# Altium project GSM.PrjPcb
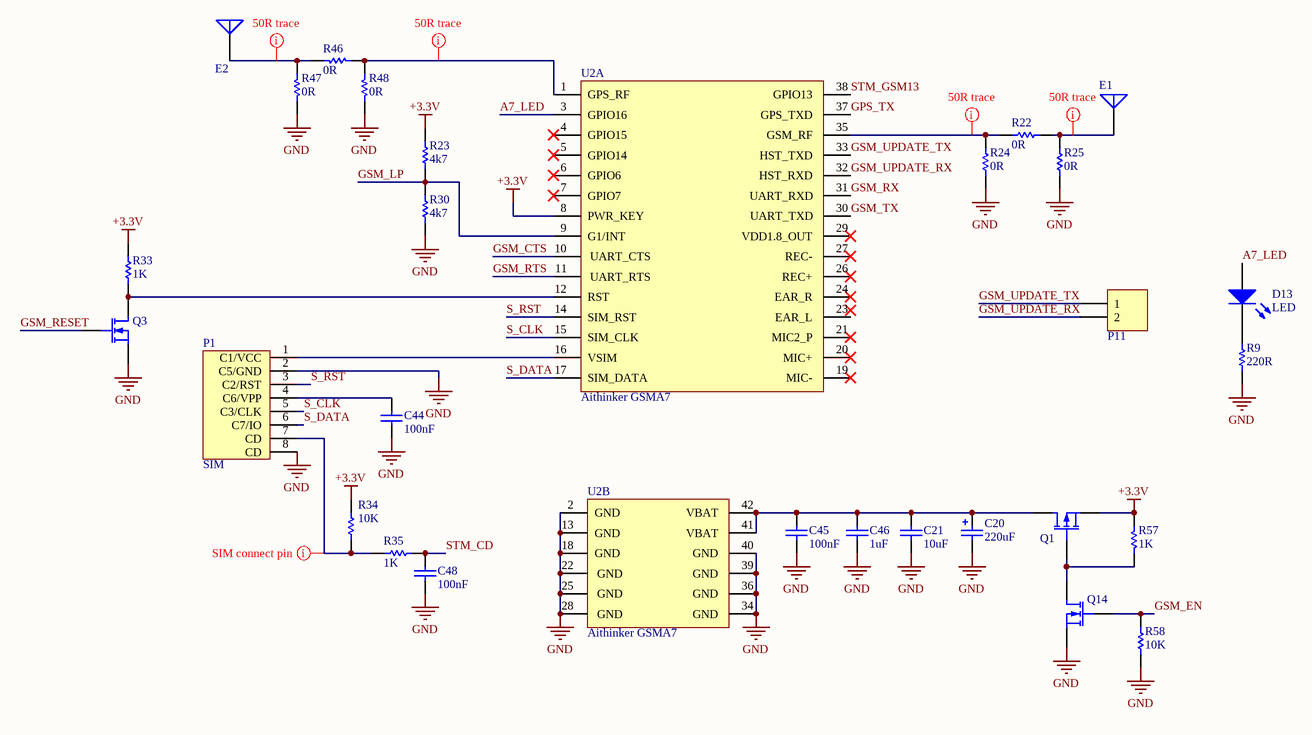
[diagram p0: GSM.SchDoc]
ProjectTitle: GSM
5 sheets, 227 parts. Net scope: global (net labels, ports and power ports of the same name join across sheets).
Board files: GSM.PcbDoc, GSM_v2.PcbDoc
Sheets:
  GSM.SchDoc
  power.SchDoc
  sensors.SchDoc
  mcu.SchDoc
  wifi.SchDoc

## Sheet GSM.SchDoc
size A3

### Parts
C20  value 220uF  [CAP-D]  (hidden comment: Tantalum 220uF)
C21  value 10uF  [C0603]  (hidden comment: Cap 10uF)
C44  value 100nF  [C0402]  (hidden comment: Cap 100nF)
C45  value 100nF  [C0402]  (hidden comment: Cap 100nF)
C46  value 1uF  [C0402]  (hidden comment: Cap 1uF)
C48  value 100nF  [C0402]  (hidden comment: Cap 100nF)
D13  LED  [0603LedRed]
E1  Antenna  [SMA connector]  (value not drawn)
E2  Antenna  [SMA connector]  (value not drawn)
P1  SIM  [SIM TRAY]
P11  Header 2  [HDR1X2]  (value not drawn)
Q1  AO3401A  [SOT23]  (value not drawn)
Q3  AO3400A  [SOT23]  (value not drawn)
Q14  AO3400A  [SOT23]  (value not drawn)
R9  value 220R  [R0402]  (hidden comment: Res_220R)
R22  value 0R  [R0402]  (hidden comment: Res_0R)
R23  value 4k7  [R0402]  (hidden comment: Res_4k7)
R24  value 0R  [R0402]  (hidden comment: Res_0R)
R25  value 0R  [R0402]  (hidden comment: Res_0R)
R30  value 4k7  [R0402]  (hidden comment: Res_4k7)
R33  value 1K  [R0402]  (hidden comment: Res_1K)
R34  value 10K  [R0402]  (hidden comment: Res_10K)
R35  value 1K  [R0402]  (hidden comment: Res_1K)
R46  value 0R  [R0402]  (hidden comment: Res_0R)
R47  value 0R  [R0402]  (hidden comment: Res_0R)
R48  value 0R  [R0402]  (hidden comment: Res_0R)
R57  value 1K  [R0402]  (hidden comment: Res_1K)
R58  value 10K  [R0402]  (hidden comment: Res_10K)
U2  Aithinker GSMA7  [A7]  (parts A,B of 2)

### Nets
+3.3V: Q1.2(S) R23.2 R33.2 R34.2 R57.2 U2.8(PWR_KEY)
GND: C20.1 C21.1 C44.1 C45.1 C46.1 C48.1 P1.2(C5/GND) P1.8(CD) Q3.2(S) Q14.2(S) R9.1 R24.1 R25.1 R30.1 R47.1 R48.1 R58.1 U2.2(GND) U2.13(GND) U2.18(GND) U2.22(GND) U2.25(GND) U2.28(GND) U2.34(GND) U2.36(GND) U2.39(GND) U2.40(GND)
A7_LED: D13.1(A) U2.3(GPIO16)
GPS_TX: U2.37(GPS_TXD)
GSM_CTS: U2.10(UART_CTS)
GSM_EN: Q14.1(G) R58.2
GSM_LP: R23.1 R30.2 U2.9(G1/INT)
GSM_RESET: Q3.1(G)
GSM_RTS: U2.11(UART_RTS)
GSM_RX: U2.31(UART_RXD)
GSM_TX: U2.30(UART_TXD)
GSM_UPDATE_RX: P11.2 U2.32(HST_RXD)
GSM_UPDATE_TX: P11.1 U2.33(HST_TXD)
S_CLK: P1.5(C3/CLK) U2.15(SIM_CLK)
S_DATA: P1.6(C7/IO) U2.17(SIM_DATA)
S_RST: P1.3(C2/RST) U2.14(SIM_RST)
STM_CD: C48.2 R35.2
STM_GSM13: U2.38(GPIO13)
NetC20_2: C20.2 C21.2 C45.2 C46.2 Q1.3(D) U2.41(VBAT) U2.42(VBAT)
NetC44_2: C44.2 P1.4(C6/VPP)
NetD13_2: D13.2(K) R9.2
NetE1_1: E1.1(A) R22.2 R25.2
NetE2_1: E2.1(A) R46.2 R47.2
NetP1_1: P1.1(C1/VCC) U2.16(VSIM)
NetP1_7: P1.7(CD) R34.1 R35.1
NetQ1_1: Q1.1(G) Q14.3(D) R57.1
NetQ3_3: Q3.3(D) R33.1 U2.12(RST)
NetR22_1: R22.1 R24.2 U2.35(GSM_RF)
NetR46_1: R46.1 R48.2 U2.1(GPS_RF)

Not connected (* = marked no-connect by the designer): U2 4(GPIO15)* 5(GPIO14)* 6(GPIO6)* 7(GPIO7)* 19(MIC-)* 20(MIC+)* 21(MIC2_P)* 23(EAR_L) 24(EAR_R)* 26(REC+)* 27(REC-)* 29(VDD1.8_OUT)*

### Layout directives
mark named 50R trace: NetE1_1, NetE2_1, NetR22_1, NetR46_1
mark named SIM connect pin: NetP1_7

### Library data of the parts
C20 = Tantalum 220uF: Polarized Tantalum Capacitor
C21 = Cap 10uF: Capacitor
C44 C45 C48 = Cap 100nF: Capacitor
C46 = Cap 1uF: Capacitor
D13 = LED: Typical RED GaAs LED; Published: 8-Jun-2000; LatestRevisionDate: 08-Jul-2005; LatestRevisionNote: Mech Layer 1 removed.; PackageReference: LED-1; Publisher: Altium Limited; PackageDescription: LED; 2 Leads
E1 E2 = Antenna: Generic Antenna; Published: 24-Mar-1999; LatestRevisionDate: 17-Jul-2002; LatestRevisionNote: Re-released for DXP Platform.; PackageReference: PIN1; Publisher: Altium Limited; ComponentLink1Description: tme; ComponentLink1URL: https://www.tme.eu/pl/details/rf2-19a-t-00-50-g/zlacza-sma-smb-smc/adam-tech/
P1 = SIM: SIM card connector; ComponentLink1Description: tme; ComponentLink1URL: https://www.tme.eu/pl/details/mx-47553-0001/zlacza-do-kart/molex/47553-0001/; ComponentLink2Description: molex; ComponentLink2URL: https://www.molex.com/molex/products/part-detail/memory_card_socket/0475530001
P11 = Header 2: Header, 2-Pin; LatestRevisionDate: 17-Jul-2002; LatestRevisionNote: Re-released for DXP Platform.; Publisher: Altium Limited
Q1 = MOSFET-P: P-Channel MOSFET AO3401A; Published: 8-Jun-2000; LatestRevisionDate: 17-Jul-2002; LatestRevisionNote: Re-released for DXP Platform.; PackageVersion: 1995/1996; PackageReference: E3; Publisher: Altium Limited; PackageDescription: TO, Flat Index; 3 In-Line, Axial Leads; Body Dia. 4.6mm; Lead Dia. 0.5 mm (max); ComponentLink1Description: datasheet; ComponentLink1URL: https://datasheet.lcsc.com/szlcsc/Alpha-Omega-Semicon-AOS-AO3401A_C15127.pdf
Q3 Q14 = MOSFET-N: N-MOSFET AO3400A; Published: 8-Jun-2000; LatestRevisionDate: 17-Jul-2002; LatestRevisionNote: Re-released for DXP Platform.; PackageVersion: 1995/1996; PackageReference: E3; Publisher: Altium Limited; PackageDescription: TO, Flat Index; 3 In-Line, Axial Leads; Body Dia. 4.6mm; Lead Dia. 0.5 mm (max); ComponentLink1Description: datasheet; ComponentLink1URL: https://datasheet.lcsc.com/szlcsc/1908271131_Youtai-Semiconductor-Co-Ltd-AO3400A_C347475.pdf
R9 = Res_220R: Resistor
R22 R24 R25 R46-R48 = Res_0R: Resistor
R23 R30 = Res_4k7: Resistor
R33 R35 R57 = Res_1K: Resistor
R34 R58 = Res_10K: Resistor
U2 = GSM_A7: Aitkinker GSM A7 module; Manufacturer: STMicroelectronics; PartNumber: STM32L152CCU6; Core: ARM Cortex-M3; D/A Converter: 2x12-bit (2 Channel); Data E2PROM nom (B): 8192; Display controller: LCD 4x18; FLASH Size (Prog) (kB): 256; I/Os (High Current): 37; Internal RAM Size (kB): 32; Packing: Tray; Supply Voltage(Vcc) min (V): 1.65; DatasheetVersion: Rev. 3; PackageVersion: Rev. 1, 04/2013; PackageReference: UFQFPN48; PackageDescription: 48-Pin Ultra Thin Fine Pitch Quad Flat No-Lead, 7 x 7 x 0.6 mm Body, 0.5 mm Pitch, Exposed Pad; Operating Frequency(F) (Processor speed) (MHz): 32; Mounting Technology: Surface Mount

## Sheet power.SchDoc
size A4
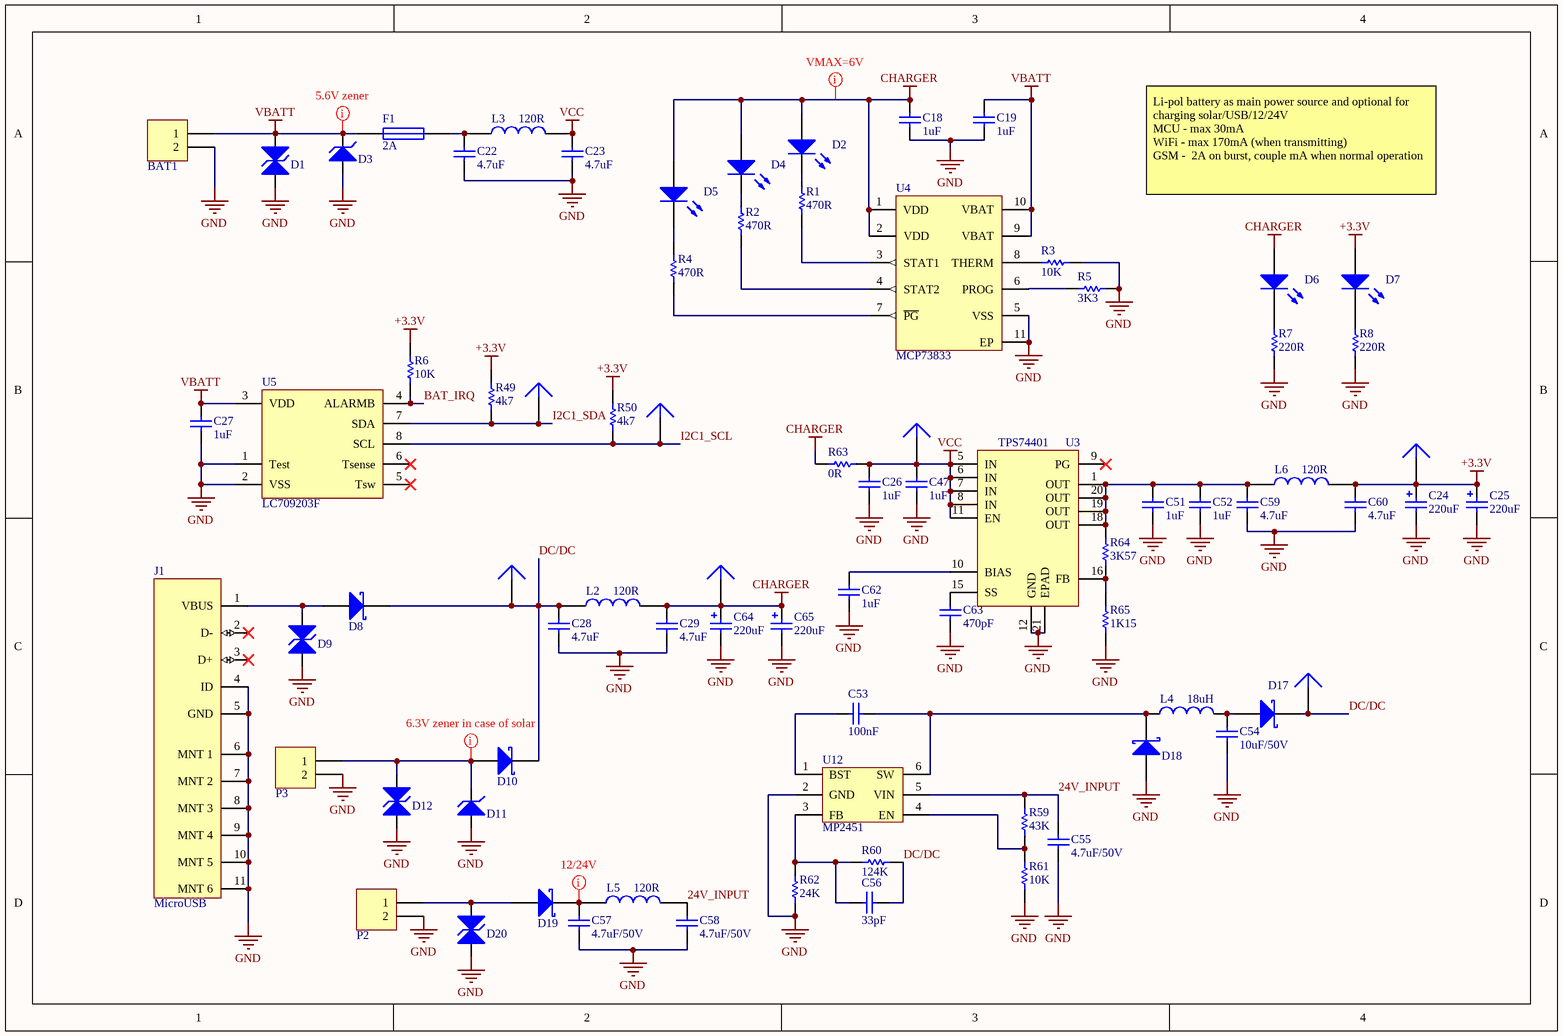
[diagram p1: power.SchDoc]

### Parts
BAT1  Header 2  [HDR1X2]  (value not drawn)
C18  value 1uF  [C0402]  (hidden comment: Cap 1uF)
C19  value 1uF  [C0402]  (hidden comment: Cap 1uF)
C22  value 4.7uF  [C0402]  (hidden comment: Cap 4.7uF)
C23  value 4.7uF  [C0402]  (hidden comment: Cap 4.7uF)
C24  value 220uF  [CAP-D]  (hidden comment: Tantalum 220uF)
C25  value 220uF  [CAP-D]  (hidden comment: Tantalum 220uF)
C26  value 1uF  [C0402]  (hidden comment: Cap 1uF)
C27  value 1uF  [C0402]  (hidden comment: Cap 1uF)
C28  value 4.7uF  [C0402]  (hidden comment: Cap 4.7uF)
C29  value 4.7uF  [C0402]  (hidden comment: Cap 4.7uF)
C47  value 1uF  [C0402]  (hidden comment: Cap 1uF)
C51  value 1uF  [C0402]  (hidden comment: Cap 1uF)
C52  value 1uF  [C0402]  (hidden comment: Cap 1uF)
C53  value 100nF  [C0402]  (hidden comment: Cap 100nF)
C54  value 10uF/50V  [C1206]  (hidden comment: Cap 10uF/50V)
C55  value 4.7uF/50V  [C1206]  (hidden comment: Cap 4.7uF/50V)
C56  value 33pF  [C0402]  (hidden comment: Cap 33pF)
C57  value 4.7uF/50V  [C1206]  (hidden comment: Cap 4.7uF/50V)
C58  value 4.7uF/50V  [C1206]  (hidden comment: Cap 4.7uF/50V)
C59  value 4.7uF  [C0402]  (hidden comment: Cap 4.7uF)
C60  value 4.7uF  [C0402]  (hidden comment: Cap 4.7uF)
C62  value 1uF  [C0402]  (hidden comment: Cap 1uF)
C63  value 470pF  [C0402]  (hidden comment: Cap 470pF)
C64  value 220uF  [CAP-D]  (hidden comment: Tantalum 220uF)
C65  value 220uF  [CAP-D]  (hidden comment: Tantalum 220uF)
D1  TVS Bidirectional  [SMA]  (value not drawn)
D2  LED  [0603LedRed]  (value not drawn)
D3  Zener Diode  [miniMELF]  (value not drawn)
D4  LED  [0603LedRed]  (value not drawn)
D5  LED  [0603LedRed]  (value not drawn)
D6  LED  [0603LedRed]  (value not drawn)
D7  LED  [0603LedRed]  (value not drawn)
D8  STPS1L30U  [SOD-123A]  (value not drawn)
D9  TVS Bidirectional  [SMA]  (value not drawn)
D10  STPS1L30U  [SOD-123A]  (value not drawn)
D11  Zener Diode  [miniMELF]  (value not drawn)
D12  TVS Bidirectional  [SMA]  (value not drawn)
D17  D Schottky  [SOD-123A]  (value not drawn)
D18  STPS1L30U  [SOD-123A]  (value not drawn)
D19  STPS1L30U  [SOD-123A]  (value not drawn)
D20  TVS Bidirectional  [SMA]  (value not drawn)
F1  2A  [R1206]
J1  MicroUSB  [MicroUSB]
L2  120R  [0805FerriteBead]
L3  120R  [0805FerriteBead]
L4  value 18uH  [WE-TPC_4828]  (hidden comment: Inductor 18uH)
L5  120R  [0805FerriteBead]
L6  120R  [0805FerriteBead]
P2  Header 2  [HDR1x2_screw]  (value not drawn)
P3  Header 2  [HDR1x2_screw]  (value not drawn)
P12  Plug  [pin smd]  (value not drawn)  (no BOM)
P13  Plug  [pin smd]  (value not drawn)  (no BOM)
P15  Plug  [pin smd]  (value not drawn)  (no BOM)
P16  Plug  [pin smd]  (value not drawn)  (no BOM)
P17  Plug  [pin smd]  (value not drawn)  (no BOM)
P18  Plug  [pin smd]  (value not drawn)  (no BOM)
P19  Plug  [pin smd]  (value not drawn)  (no BOM)
R1  value 470R  [R0402]  (hidden comment: Res_470R)
R2  value 470R  [R0402]  (hidden comment: Res_470R)
R3  value 10K  [R0402]  (hidden comment: Res_10K)
R4  value 470R  [R0402]  (hidden comment: Res_470R)
R5  value 3K3  [R0402]  (hidden comment: Res_3K3)
R6  value 10K  [R0402]  (hidden comment: Res_10K)
R7  value 220R  [R0402]  (hidden comment: Res_220R)
R8  value 220R  [R0402]  (hidden comment: Res_220R)
R49  value 4k7  [R0402]  (hidden comment: Res_4k7)
R50  value 4k7  [R0402]  (hidden comment: Res_4k7)
R59  value 43K  [R0402]  (hidden comment: Res_43K)
R60  value 124K  [R0402]  (hidden comment: Res_124K)
R61  value 10K  [R0402]  (hidden comment: Res_10K)
R62  value 24K  [R0402]  (hidden comment: Res_24K)
R63  value 0R  [R0402]  (hidden comment: Res_0R)
R64  value 3K57  [R0402]  (hidden comment: Res_3K57)
R65  value 1K15  [R0402]  (hidden comment: Res_1K15)
U3  TPS74401  [PVQFN20]
U4  MCP73833  [DFN 3x3]
U5  LC709203F  [WDFN8]
U12  MP2451  [SOT23-6]

### Nets
+3.3V: C24.2 C25.2 C60.2 D7.1(A) L6.2 P16.1 R6.2 R49.2 R50.2
CHARGER: C18.2 C29.2 C64.2 C65.2 D2.1(A) D4.1(A) D5.1(A) D6.1(A) L2.2 P18.1 R63.1 U4.1(VDD) U4.2(VDD)
GND: BAT1.2 C18.1 C19.1 C22.1 C23.1 C24.1 C25.1 C26.1 C27.1 C28.1 C29.1 C47.1 C51.1 C52.1 C54.1 C55.1 C57.1 C58.1 C59.1 C60.1 C62.1 C63.1 C64.1 C65.1 D1.1 D3.1(A) D9.1 D11.1(A) D12.1 D18.1(A) D20.1 J1.4(ID) J1.5(GND) J1.6(MNT_1) J1.7(MNT_2) J1.8(MNT_3) J1.9(MNT_4) J1.10(MNT_5) J1.11(MNT_6) P2.2 P3.2 R3.2 R5.2 R7.1 R8.1 R61.1 R62.1 R65.1 U3.12(GND) U3.21(EPAD) U4.5(VSS) U4.11(EP) U5.1(Test) U5.2(VSS) U12.2(GND)
VBATT: BAT1.1 C19.2 C27.2 D1.2 D3.2(K) F1.1 U4.9(VBAT) U4.10(VBAT) U5.3(VDD)
VCC: C23.2 C26.2 C47.2 L3.2 P15.1 R63.2 U3.5(IN) U3.6(IN) U3.7(IN) U3.8(IN) U3.11(EN)
24V_INPUT: C55.2 C58.2 L5.2 R59.2 U12.5(VIN)
BAT_IRQ: R6.1 U5.4(ALARMB)
DC/DC: C28.2 C56.2 D8.2(K) D10.2(K) D17.2(K) L2.1 P17.1 P19.1 R60.2
I2C1_SCL: P13.1 R50.1 U5.8(SCL)
I2C1_SDA: P12.1 R49.1 U5.7(SDA)
NetC22_2: C22.2 F1.2 L3.1
NetC51_2: C51.2 C52.2 C59.2 L6.1 R64.2 U3.1(OUT) U3.18(OUT) U3.19(OUT) U3.20(OUT)
NetC53_1: C53.1 U12.1(BST)
NetC53_2: C53.2 D18.2(K) L4.1 U12.6(SW)
NetC54_2: C54.2 D17.1(A) L4.2
NetC56_1: C56.1 R60.1 R62.2 U12.3(FB)
NetC57_2: C57.2 D19.2(K) L5.1
NetC62_2: C62.2 U3.10(BIAS)
NetC63_2: C63.2 U3.15(SS)
NetD2_2: D2.2(K) R1.2
NetD4_2: D4.2(K) R2.2
NetD5_2: D5.2(K) R4.2
NetD6_2: D6.2(K) R7.2
NetD7_2: D7.2(K) R8.2
NetD8_1: D8.1(A) D9.2 J1.1(VBUS)
NetD10_1: D10.1(A) D11.2(K) D12.2 P3.1
NetD19_1: D19.1(A) D20.2 P2.1
NetR1_1: R1.1 U4.3(STAT1)
NetR2_1: R2.1 U4.4(STAT2)
NetR3_1: R3.1 U4.8(THERM)
NetR4_1: R4.1 U4.7(~{PG})
NetR5_1: R5.1 U4.6(PROG)
NetR59_1: R59.1 R61.2 U12.4(EN)
NetR64_1: R64.1 R65.2 U3.16(FB)

Not connected (* = marked no-connect by the designer): J1 2(D-)* 3(D+)*; U3 9(PG)*; U5 5(Tsw)* 6(Tsense)*

### Layout directives
mark named 6.3V zener in case of solar: NetD10_1
mark named 5.6V zener: VBATT
mark named VMAX=6V: CHARGER
mark named 12/24V: NetC57_2

### Notes on the sheet
- Li-pol battery as main power source and optional for charging solar/USB/12/24V
  MCU - max 30mA
  WiFi - max 170mA (when transmitting)
  GSM -  2A on burst, couple mA when normal operation

### Library data of the parts
BAT1 P2 P3 = Header 2: Header, 2-Pin; LatestRevisionDate: 17-Jul-2002; LatestRevisionNote: Re-released for DXP Platform.; Publisher: Altium Limited
C18 C19 C26 C27 C47 C51 C52 C62 = Cap 1uF: Capacitor
C22 C23 C28 C29 C59 C60 = Cap 4.7uF: Capacitor
C24 C25 C64 C65 = Tantalum 220uF: Polarized Tantalum Capacitor
C53 = Cap 100nF: Capacitor
C54 = Cap 10uF/50V: Capacitor
C55 C57 C58 = Cap 4.7uF/50V: Capacitor
C56 = Cap 33pF: Capacitor
C63 = Cap 470pF: Capacitor
D1 D9 D12 D20 = TVS_bidirectional: SMAJ40CA; Published: 8-Jun-2000; LatestRevisionDate: 17-Jul-2002; LatestRevisionNote: Re-released for DXP Platform.; PackageReference: DIODE-0.7; Publisher: Altium Limited; PackageDescription: Diode, Thru-Hole; 2 Leads; 0.7 in Pin Spacing; ComponentLink1Description: datasheet; ComponentLink1URL: https://datasheet.lcsc.com/szlcsc/1912111437_Jiangsu-JieJie-Microelectronics-SMAJ40CA_C364660.pdf
D2 D4-D7 = LED: Typical RED GaAs LED; Published: 8-Jun-2000; LatestRevisionDate: 08-Jul-2005; LatestRevisionNote: Mech Layer 1 removed.; PackageReference: LED-1; Publisher: Altium Limited; PackageDescription: LED; 2 Leads
D3 D11 = Diode Zener: Published: 8-Jun-2000; LatestRevisionDate: 17-Jul-2002; LatestRevisionNote: Re-released for DXP Platform.; PackageReference: DIODE-0.7; Publisher: Altium Limited; PackageDescription: Diode, Thru-Hole; 2 Leads; 0.7 in Pin Spacing; ComponentLink1Description: farnell; ComponentLink1URL: https://pl.farnell.com/on-semiconductor/mm3z5v6st1g/zener-diode-5-6v-sod-323/dp/2463484
D8 D10 D18 D19 = Diode Schottky: Schottky Rectifier; Note: Terminal 2 is the TAB and is electrically connected to the cathode; Published: 8-Jun-2000; LatestRevisionDate: 17-Jul-2002; LatestRevisionNote: Re-released for DXP Platform.; DatasheetVersion: Dec-1997; PackageVersion: Feb-1998; PackageReference: TO-220AC; Publisher: Altium Limited; PackageDescription: TO, Thru-Hole, Vertical, Heatsink Mounted; 3 In-Line Leads (1 Absent); Pitch 2.54 mm; ComponentLink1Description: octopart; ComponentLink1URL: https://octopart.com/rb161mm-20tr-rohm-50255147?r=sp&s=49MKJYpmTviEGZkvRDL2JQ
D17 = D Schottky: Schottky Diode; Published: 8-Jun-2000; LatestRevisionDate: 17-Jul-2002; LatestRevisionNote: Re-released for DXP Platform.; PackageReference: SMB; Publisher: Altium Limited; PackageDescription: DO-214-AA/SMB; 2 C-Bend Leads; Body 5.3 x 3.6 mm, inc. leads (LxW); Code_JEDEC: DO-214-AA
F1 = Fuse_2A: Fuse / 2850030; Published: 8-Jun-2000; LatestRevisionDate: 17-Jul-2002; LatestRevisionNote: Re-released for DXP Platform.; PackageReference: PIN-W2/E2.8; Publisher: Altium Limited; PackageDescription: Thru-Hole; 2 Leads; ComponentLink1Description: farnell; ComponentLink1URL: https://pl.farnell.com/multicomp/mccfb1206ttt-2/fuse-smd-2a-slow-blow-1206/dp/2850030
L2 L3 L5 L6 = Ferrite bead 120R: Ferrite bead; Value: 10mH; Published: 24-Mar-1999; LatestRevisionDate: 17-Jul-2002; LatestRevisionNote: Re-released for DXP Platform.; PackageReference: AXIAL-0.9; Publisher: Altium Limited; PackageDescription: Axial Device, Thru-Hole; 2 Leads; 0.9 in Pin Spacing; ComponentLink1Description: Ferrite bead TDK MMZ2012Y300B; ComponentLink1URL: https://www.tme.eu/pl/details/mmz2012y300b/ferryty-koraliki/tdk/
L4 = Inductor 18uH: WE 744 043 180; Code_IEC: 1005; Published: 8-Jun-2000; LatestRevisionDate: 29-May-2009; LatestRevisionNote: IPC-7351 Footprint Added.; PackageReference: 0402-A; Publisher: Altium Limited; PackageDescription: Chip Inductor; Code_JEITA: 0402
R1 R2 R4 = Res_470R: Resistor
R3 R6 R61 = Res_10K: Resistor
R5 = Res_3K3: Resistor
R7 R8 = Res_220R: Resistor
R49 R50 = Res_4k7: Resistor
R59 = Res_43K: Resistor
R60 = Res_124K: Resistor
R62 = Res_24K: Resistor
R63 = Res_0R: Resistor
R64 = Res_3K57: Resistor
R65 = Res_1K15: Resistor
U3 = TPS74401: Very Low Dropout Regulator; ComponentLink1Description: datasheet; ComponentLink1URL: https://datasheet.lcsc.com/szlcsc/Texas-Instruments-TI-TPS74401RGWR_C138728.pdf
U4 = MCP73833: Li-Ion, Li-Polymer Charge Management Controller; PartNumber: MCP73831T-2ATI/OT; PackageDescription: 5-Lead Plastic Small Outline Transistor (OT) [SOT-23]; PackageVersion: revBB, Aug-2009; DatasheetVersion: revE, Sep-2008; Code_IPC: SOT23-5; PackageReference: SOT-23-OT5; ComponentLink1Description: octopart; ComponentLink1URL: https://octopart.com/mcp73833-fci%2Fmf-microchip-664198?r=sp&s=e45vLxEIQu2vH537JitsJQ
U5 = LC709203F: Smart LiB GaugeBattery Fuel Gauge LSI For 1‐Cell Lithium‐ion/Polymer (Li+); ComponentLink1Description: Datasheet; ComponentLink1URL: https://www.onsemi.com/pub/Collateral/LC709203F-D.PDF
U12 = MP2451: step down coverter; ComponentLink1Description: datasheet; ComponentLink1URL: https://www.monolithicpower.com/en/documentview/productdocument/index/version/2/document_type/Datasheet/lang/en/sku/MP2451/document_id/253/
J1 = MicroUSB: ComponentLink1Description: octopart; ComponentLink1URL: https://octopart.com/1050170001-molex-11866487?r=sp&s=Rj0fqO-uQZ6OfaPf4COaug
P12 P13 P15-P19 = Plug: LatestRevisionDate: 17-Jul-2002; LatestRevisionNote: Re-released for DXP Platform.; Publisher: Altium Limited

## Sheet sensors.SchDoc
size A4
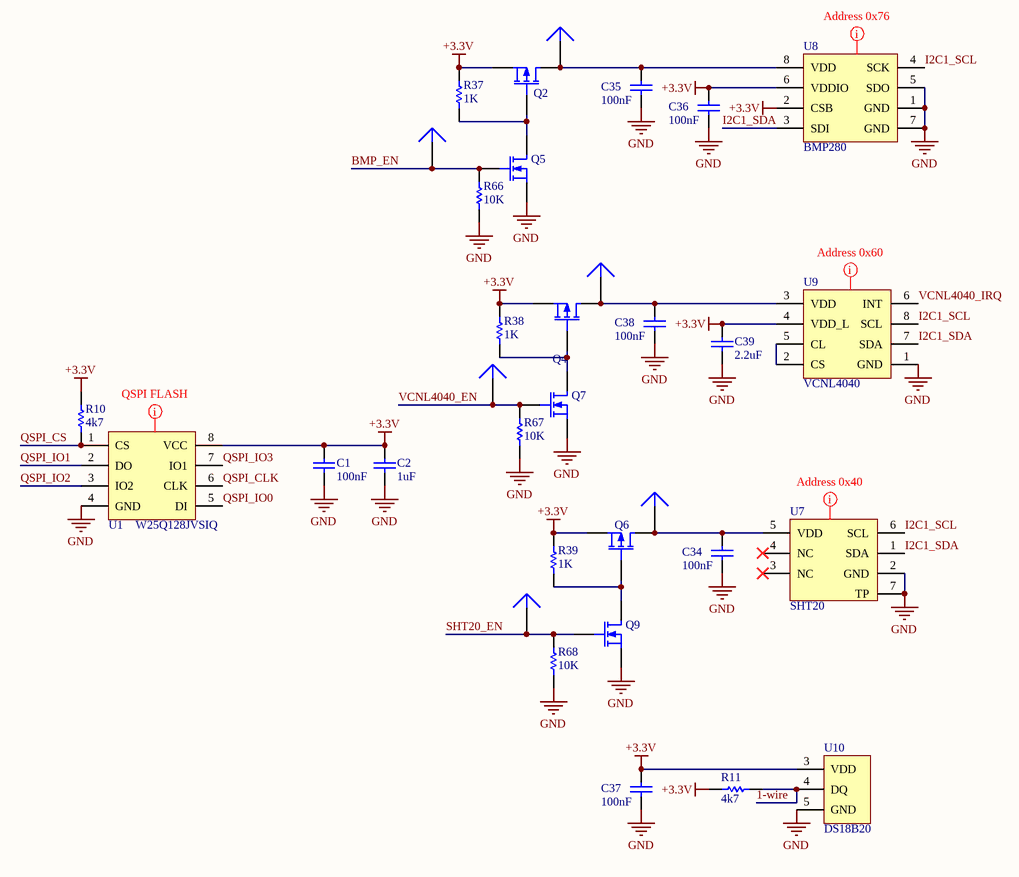
[diagram p2: sensors.SchDoc]

### Parts
C1  value 100nF  [C0402]  (hidden comment: Cap 100nF)
C2  value 1uF  [C0402]  (hidden comment: Cap 1uF)
C34  value 100nF  [C0402]  (hidden comment: Cap 100nF)
C35  value 100nF  [C0402]  (hidden comment: Cap 100nF)
C36  value 100nF  [C0402]  (hidden comment: Cap 100nF)
C37  value 100nF  [C0402]  (hidden comment: Cap 100nF)
C38  value 100nF  [C0402]  (hidden comment: Cap 100nF)
C39  value 2.2uF  [C0402]  (hidden comment: Cap 2.2uF)
P20  Plug  [pin smd]  (value not drawn)  (no BOM)
P21  Plug  [pin smd]  (value not drawn)  (no BOM)
P22  Plug  [pin smd]  (value not drawn)  (no BOM)
P26  Plug  [pin smd]  (value not drawn)  (no BOM)
P27  Plug  [pin smd]  (value not drawn)  (no BOM)
P28  Plug  [pin smd]  (value not drawn)  (no BOM)
Q2  AO3401A  [SOT23]  (value not drawn)
Q4  AO3401A  [SOT23]  (value not drawn)
Q5  AO3400A  [SOT23]  (value not drawn)
Q6  AO3401A  [SOT23]  (value not drawn)
Q7  AO3400A  [SOT23]  (value not drawn)
Q9  AO3400A  [SOT23]  (value not drawn)
R10  value 4k7  [R0402]  (hidden comment: Res_4k7)
R11  value 4k7  [R0402]  (hidden comment: Res_4k7)
R37  value 1K  [R0402]  (hidden comment: Res_1K)
R38  value 1K  [R0402]  (hidden comment: Res_1K)
R39  value 1K  [R0402]  (hidden comment: Res_1K)
R66  value 10K  [R0402]  (hidden comment: Res_10K)
R67  value 10K  [R0402]  (hidden comment: Res_10K)
R68  value 10K  [R0402]  (hidden comment: Res_10K)
U1  W25Q128JVSIQ  [SOIC8_208-mil]
U7  SHT20  [DFN6]
U8  BMP280  [LGA8]
U9  VCNL4040  [VCNL4040M3OE]
U10  DS18B20  [SO8]

### Nets
+3.3V: C1.2 C2.2 C36.2 C37.2 C39.2 Q2.2(S) Q4.2(S) Q6.2(S) R10.2 R11.1 R37.2 R38.2 R39.2 U1.8(VCC) U8.2(CSB) U8.6(VDDIO) U9.4(VDD_L) U10.3(VDD)
GND: C1.1 C2.1 C34.1 C35.1 C36.1 C37.1 C38.1 C39.1 Q5.2(S) Q7.2(S) Q9.2(S) R66.1 R67.1 R68.1 U1.4(GND) U7.2(GND) U7.7(TP) U8.1(GND) U8.5(SDO) U8.7(GND) U9.1(GND) U10.5(GND)
1-wire: R11.2 U10.4(DQ)
BMP_EN: P26.1 Q5.1(G) R66.2
I2C1_SCL: U7.6(SCL) U8.4(SCK) U9.8(SCL)
I2C1_SDA: U7.1(SDA) U8.3(SDI) U9.7(SDA)
QSPI_CLK: U1.6(CLK)
QSPI_CS: R10.1 U1.1(CS)
QSPI_IO0: U1.5(DI)
QSPI_IO1: U1.2(DO)
QSPI_IO2: U1.3(IO2)
QSPI_IO3: U1.7(IO1)
SHT20_EN: P28.1 Q9.1(G) R68.2
VCNL4040_EN: P27.1 Q7.1(G) R67.2
VCNL4040_IRQ: U9.6(INT)
NetC34_2: C34.2 P22.1 Q6.3(D) U7.5(VDD)
NetC35_2: C35.2 P20.1 Q2.3(D) U8.8(VDD)
NetC38_2: C38.2 P21.1 Q4.3(D) U9.3(VDD)
NetQ2_1: Q2.1(G) Q5.3(D) R37.1
NetQ4_1: Q4.1(G) Q7.3(D) R38.1
NetQ6_1: Q6.1(G) Q9.3(D) R39.1
NetU9_2: U9.2(CS) U9.5(CL)

Not connected (* = marked no-connect by the designer): U7 3(NC)* 4(NC)*

### Layout directives
mark named Address 0x76: (no net found under the mark)
mark named Address 0x60: (no net found under the mark)
mark named Address 0x40: (no net found under the mark)
mark named QSPI FLASH: (no net found under the mark)

### Library data of the parts
C1 C34-C38 = Cap 100nF: Capacitor
C2 = Cap 1uF: Capacitor
C39 = Cap 2.2uF: Capacitor
Q2 Q4 Q6 = MOSFET-P: P-Channel MOSFET AO3401A; Published: 8-Jun-2000; LatestRevisionDate: 17-Jul-2002; LatestRevisionNote: Re-released for DXP Platform.; PackageVersion: 1995/1996; PackageReference: E3; Publisher: Altium Limited; PackageDescription: TO, Flat Index; 3 In-Line, Axial Leads; Body Dia. 4.6mm; Lead Dia. 0.5 mm (max); ComponentLink1Description: datasheet; ComponentLink1URL: https://datasheet.lcsc.com/szlcsc/Alpha-Omega-Semicon-AOS-AO3401A_C15127.pdf
Q5 Q7 Q9 = MOSFET-N: N-MOSFET AO3400A; Published: 8-Jun-2000; LatestRevisionDate: 17-Jul-2002; LatestRevisionNote: Re-released for DXP Platform.; PackageVersion: 1995/1996; PackageReference: E3; Publisher: Altium Limited; PackageDescription: TO, Flat Index; 3 In-Line, Axial Leads; Body Dia. 4.6mm; Lead Dia. 0.5 mm (max); ComponentLink1Description: datasheet; ComponentLink1URL: https://datasheet.lcsc.com/szlcsc/1908271131_Youtai-Semiconductor-Co-Ltd-AO3400A_C347475.pdf
R10 R11 = Res_4k7: Resistor
R37-R39 = Res_1K: Resistor
R66-R68 = Res_10K: Resistor
U1 = flash_memory: SPI Flash  memory 128MB; ComponentLink1Description: tme; ComponentLink1URL: https://datasheet.lcsc.com/szlcsc/Winbond-Elec-W25Q128JVSIQTR_C97521.pdf
U7 = SHT20: Humidity and Temperature SensorIC; ComponentLink1Description: Datasheet; ComponentLink1URL: https://datasheet.lcsc.com/szlcsc/Sensirion-SHT20_C53865.pdf
U8 = BMP280: Digital Pressure Sensor; ComponentLink1Description: Datasheet; ComponentLink1URL: https://datasheet.lcsc.com/szlcsc/Bosch-Sensortec-BMP280_C83291.pdf
U9 = VCNL4040: Fully Integrated Proximity and Ambient Light Sensor withInfrared Emitter, I2C Interface, and Interrupt Function; ComponentLink1Description: Datasheet; ComponentLink1URL: https://datasheet.lcsc.com/szlcsc/Vishay-Intertech-VCNL4040M3OE_C142526.pdf
P20-P22 P26-P28 = Plug: LatestRevisionDate: 17-Jul-2002; LatestRevisionNote: Re-released for DXP Platform.; Publisher: Altium Limited
U10 = DS18B20: LatestRevisionDate: 17-Jul-2002; LatestRevisionNote: Re-released for DXP Platform.; Publisher: Altium Limited

## Sheet mcu.SchDoc
size A4
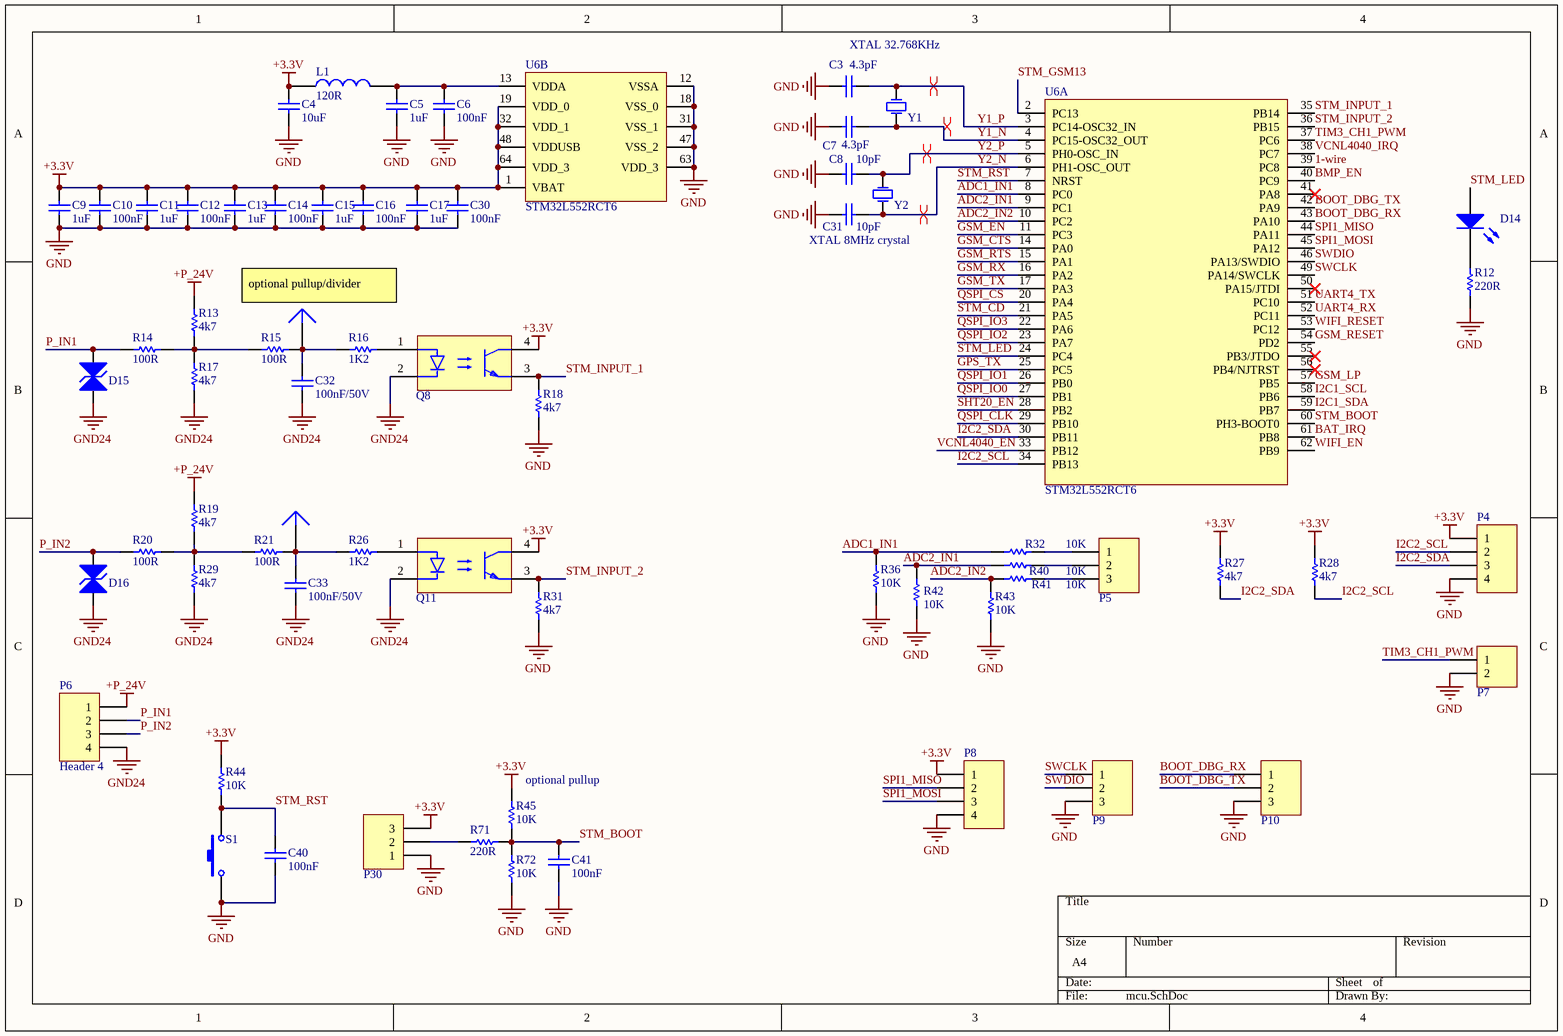
[diagram p3: mcu.SchDoc]

### Parts
C3  value 4.3pF  [C0402]  (hidden comment: Cap 4.3pF)
C4  value 10uF  [C0402]  (hidden comment: Cap 10uF)
C5  value 1uF  [C0402]  (hidden comment: Cap 1uF)
C6  value 100nF  [C0402]  (hidden comment: Cap 100nF)
C7  value 4.3pF  [C0402]  (hidden comment: Cap 4.3pF)
C8  value 10pF  [C0402]  (hidden comment: Cap 10pF)
C9  value 1uF  [C0402]  (hidden comment: Cap 1uF)
C10  value 100nF  [C0402]  (hidden comment: Cap 100nF)
C11  value 1uF  [C0402]  (hidden comment: Cap 1uF)
C12  value 100nF  [C0402]  (hidden comment: Cap 100nF)
C13  value 1uF  [C0402]  (hidden comment: Cap 1uF)
C14  value 100nF  [C0402]  (hidden comment: Cap 100nF)
C15  value 1uF  [C0402]  (hidden comment: Cap 1uF)
C16  value 100nF  [C0402]  (hidden comment: Cap 100nF)
C17  value 1uF  [C0402]  (hidden comment: Cap 1uF)
C30  value 100nF  [C0402]  (hidden comment: Cap 100nF)
C31  value 10pF  [C0402]  (hidden comment: Cap 10pF)
C32  value 100nF/50V  [C1206]  (hidden comment: Cap 100nF/50V)
C33  value 100nF/50V  [C1206]  (hidden comment: Cap 100nF/50V)
C40  value 100nF  [C0402]  (hidden comment: Cap 100nF)
C41  value 100nF  [C0402]  (hidden comment: Cap 100nF)
D14  LED  [0603LedRed]  (value not drawn)
D15  TVS Bidirectional  [SMA]  (value not drawn)
D16  TVS Bidirectional  [SMA]  (value not drawn)
L1  120R  [0805FerriteBead]
P4  Header 4  [HDR1X4]  (value not drawn)
P5  Header 3  [HDR1X3]  (value not drawn)
P6  Header 4  [HDR1X4]
P7  Header 2  [HDR1X2]  (value not drawn)
P8  Header 4  [HDR1X4]  (value not drawn)
P9  Header 3  [HDR1X3]  (value not drawn)
P10  Header 3  [HDR1X3]  (value not drawn)
P23  Plug  [pin smd]  (value not drawn)  (no BOM)
P24  Plug  [pin smd]  (value not drawn)  (no BOM)
P30  Header 3  [HDR1X3]  (value not drawn)
Q8  TLP291  [SO4]  (value not drawn)
Q11  TLP291  [SO4]  (value not drawn)
R12  value 220R  [R0402]  (hidden comment: Res_220R)
R13  value 4k7  [R0805]  (hidden comment: Res_4k7)
R14  value 100R  [R0805]  (hidden comment: Res_100R)
R15  value 100R  [R0805]  (hidden comment: Res_100R)
R16  value 1K2  [R0805]  (hidden comment: Res_1K2)
R17  value 4k7  [R0805]  (hidden comment: Res_4k7)
R18  value 4k7  [R0402]  (hidden comment: Res_4k7)
R19  value 4k7  [R0805]  (hidden comment: Res_4k7)
R20  value 100R  [R0805]  (hidden comment: Res_100R)
R21  value 100R  [R0805]  (hidden comment: Res_100R)
R26  value 1K2  [R0805]  (hidden comment: Res_1K2)
R27  value 4k7  [R0402]  (hidden comment: Res_4k7)
R28  value 4k7  [R0402]  (hidden comment: Res_4k7)
R29  value 4k7  [R0805]  (hidden comment: Res_4k7)
R31  value 4k7  [R0402]  (hidden comment: Res_4k7)
R32  value 10K  [R0402]  (hidden comment: Res_10K)
R36  value 10K  [R0402]  (hidden comment: Res_10K)
R40  value 10K  [R0402]  (hidden comment: Res_10K)
R41  value 10K  [R0402]  (hidden comment: Res_10K)
R42  value 10K  [R0402]  (hidden comment: Res_10K)
R43  value 10K  [R0402]  (hidden comment: Res_10K)
R44  value 10K  [R0402]  (hidden comment: Res_10K)
R45  value 10K  [R0402]  (hidden comment: Res_10K)
R71  value 220R  [R0402]  (hidden comment: Res_220R)
R72  value 10K  [R0402]  (hidden comment: Res_10K)
S1  switch  [TACK SWITCH 2-PAD]  (value not drawn)
U6  STM32L552RCT6  [LQFP64]  (parts A,B of 2)
Y1  XTAL 32.768KHz  [XTAL_FC-13A]
Y2  XTAL 8MHz crystal  [XTAL500X320X120]

### Nets
+3.3V: C4.2 C9.2 C10.1 C11.2 C12.1 C13.2 C14.1 C15.2 C16.1 C17.2 C30.1 L1.1 P4.1 P8.1 P30.3 Q8.4(C) Q11.4(C) R27.2 R28.2 R44.2 R45.2 U6.1(VBAT) U6.19(VDD_0) U6.32(VDD_1) U6.48(VDDUSB) U6.64(VDD_3)
+P_24V: P6.1 R13.2 R19.2
GND: C3.2 C4.1 C5.1 C6.2 C7.2 C8.2 C9.1 C10.2 C11.1 C12.2 C13.1 C14.2 C15.1 C16.2 C17.1 C30.2 C31.2 C40.1 C41.1 P4.4 P7.2 P8.4 P9.3 P10.3 P30.1 R12.1 R18.1 R31.1 R36.1 R42.1 R43.1 R72.1 S1.1 U6.12(VSSA) U6.18(VSS_0) U6.31(VSS_1) U6.47(VSS_2) U6.63(VDD_3)
GND24: C32.1 C33.1 D15.1 D16.1 P6.4 Q8.2(C) Q11.2(C) R17.1 R29.1
1-wire: U6.39(PC8)
ADC1_IN1: R32.1 R36.2 U6.8(PC0)
ADC2_IN1: R40.1 R42.2 U6.9(PC1)
ADC2_IN2: R41.1 R43.2 U6.10(PC2)
BAT_IRQ: U6.61(PB8)
BMP_EN: U6.40(PC9)
BOOT_DBG_RX: P10.1 U6.43(PA10)
BOOT_DBG_TX: P10.2 U6.42(PA9)
GPS_TX: U6.25(PC5)
GSM_CTS: U6.14(PA0)
GSM_EN: U6.11(PC3)
GSM_LP: U6.57(PB5)
GSM_RESET: U6.54(PD2)
GSM_RTS: U6.15(PA1)
GSM_RX: U6.16(PA2)
GSM_TX: U6.17(PA3)
I2C1_SCL: U6.58(PB6)
I2C1_SDA: U6.59(PB7)
I2C2_SCL: P4.2 R28.1 U6.34(PB13)
I2C2_SDA: P4.3 R27.1 U6.30(PB11)
P_IN1: D15.2 P6.2 R14.1
P_IN2: D16.2 P6.3 R20.1
QSPI_CLK: U6.29(PB10)
QSPI_CS: U6.20(PA4)
QSPI_IO0: U6.27(PB1)
QSPI_IO1: U6.26(PB0)
QSPI_IO2: U6.23(PA7)
QSPI_IO3: U6.22(PA6)
SHT20_EN: U6.28(PB2)
SPI1_MISO: P8.2 U6.44(PA11)
SPI1_MOSI: P8.3 U6.45(PA12)
STM_BOOT: C41.2 R45.1 R71.2 R72.2 U6.60(PH3-BOOT0)
STM_CD: U6.21(PA5)
STM_GSM13: U6.2(PC13)
STM_INPUT_1: Q8.3(E) R18.2 U6.35(PB14)
STM_INPUT_2: Q11.3(E) R31.2 U6.36(PB15)
STM_LED: D14.1(A) U6.24(PC4)
STM_RST: C40.2 R44.1 S1.2 U6.7(NRST)
SWCLK: P9.1 U6.49(PA14/SWCLK)
SWDIO: P9.2 U6.46(PA13/SWDIO)
TIM3_CH1_PWM: P7.1 U6.37(PC6)
UART4_RX: U6.52(PC11)
UART4_TX: U6.51(PC10)
VCNL4040_EN: U6.33(PB12)
VCNL4040_IRQ: U6.38(PC7)
WIFI_EN: U6.62(PB9)
WIFI_RESET: U6.53(PC12)
Y1_N: C7.1 U6.4(PC15-OSC32_OUT) Y1.1(OSC1)
Y1_P: C3.1 U6.3(PC14-OSC32_IN) Y1.2(OSC2)
Y2_N: C31.1 U6.6(PH1-OSC_OUT) Y2.1(OSC1)
Y2_P: C8.1 U6.5(PH0-OSC_IN) Y2.2(OSC2)
NetC5_2: C5.2 C6.1 L1.2 U6.13(VDDA)
NetC32_2: C32.2 P23.1 R15.2 R16.1
NetC33_2: C33.2 P24.1 R21.2 R26.1
NetD14_2: D14.2(K) R12.2
NetP5_1: P5.1 R32.2
NetP5_2: P5.2 R40.2
NetP5_3: P5.3 R41.2
NetP30_2: P30.2 R71.1
NetQ8_1: Q8.1(A) R16.2
NetQ11_1: Q11.1(A) R26.2
NetR13_1: R13.1 R14.2 R15.1 R17.2
NetR19_1: R19.1 R20.2 R21.1 R29.2

Not connected (* = marked no-connect by the designer): U6 41(PA8)* 50(PA15/JTDI)* 55(PB3/JTDO)* 56(PB4/NJTRST)*

### Layout directives
differential pair: Y1_N, Y1_P, Y2_N, Y2_P

### Notes on the sheet
- (near P23) optional pullup/divider
- (near R45) optional pullup

### Library data of the parts
C3 C7 = Cap 4.3pF: Capacitor
C4 = Cap 10uF: Capacitor
C5 C9 C11 C13 C15 C17 = Cap 1uF: Capacitor
C6 C10 C12 C14 C16 C30 C40 C41 = Cap 100nF: Capacitor
C8 C31 = Cap 10pF: Capacitor
C32 C33 = Cap 100nF/50V: Capacitor
D14 = LED: Typical RED GaAs LED; Published: 8-Jun-2000; LatestRevisionDate: 08-Jul-2005; LatestRevisionNote: Mech Layer 1 removed.; PackageReference: LED-1; Publisher: Altium Limited; PackageDescription: LED; 2 Leads
D15 D16 = TVS_bidirectional: SMAJ40CA; Published: 8-Jun-2000; LatestRevisionDate: 17-Jul-2002; LatestRevisionNote: Re-released for DXP Platform.; PackageReference: DIODE-0.7; Publisher: Altium Limited; PackageDescription: Diode, Thru-Hole; 2 Leads; 0.7 in Pin Spacing; ComponentLink1Description: datasheet; ComponentLink1URL: https://datasheet.lcsc.com/szlcsc/1912111437_Jiangsu-JieJie-Microelectronics-SMAJ40CA_C364660.pdf
L1 = Ferrite bead 120R: Ferrite bead; Value: 10mH; Published: 24-Mar-1999; LatestRevisionDate: 17-Jul-2002; LatestRevisionNote: Re-released for DXP Platform.; PackageReference: AXIAL-0.9; Publisher: Altium Limited; PackageDescription: Axial Device, Thru-Hole; 2 Leads; 0.9 in Pin Spacing; ComponentLink1Description: Ferrite bead TDK MMZ2012Y300B; ComponentLink1URL: https://www.tme.eu/pl/details/mmz2012y300b/ferryty-koraliki/tdk/
P4 P6 P8 = Header 4: Header, 4-Pin; LatestRevisionDate: 17-Jul-2002; LatestRevisionNote: Re-released for DXP Platform.; Publisher: Altium Limited
P5 P9 P10 P30 = Header 3: Header, 3-Pin; LatestRevisionDate: 17-Jul-2002; LatestRevisionNote: Re-released for DXP Platform.; Publisher: Altium Limited
P7 = Header 2: Header, 2-Pin; LatestRevisionDate: 17-Jul-2002; LatestRevisionNote: Re-released for DXP Platform.; Publisher: Altium Limited
Q8 Q11 = TLP291: OPTO  TLP291; ComponentLink1Description: datasheet; ComponentLink1URL: https://datasheet.lcsc.com/szlcsc/TOSHIBA-TLP291-GB-TP-SE-T_C55144.pdf
R12 R71 = Res_220R: Resistor
R13 R17-R19 R27-R29 R31 = Res_4k7: Resistor
R14 R15 R20 R21 = Res_100R: Resistor
R16 R26 = Res_1K2: Resistor
R32 R36 R40-R45 R72 = Res_10K: Resistor
U6 = STM32L552RCT6: Arm Cortex-M33 with Trust Zone, MCU 110 MHz with 512K Flash 256K Ram memory LQFP64; Manufacturer: STMicroelectronics; PartNumber: STM32L152CCU6; D/A Converter: 2x12-bit (2 Channel); Data E2PROM nom (B): 8192; Display controller: LCD 4x18; FLASH Size (Prog) (kB): 256; I/Os (High Current): 37; Internal RAM Size (kB): 32; Packing: Tray; Supply Voltage(Vcc) min (V): 1.65; DatasheetVersion: Rev. 3; PackageVersion: Rev. 1, 04/2013; PackageReference: UFQFPN48; PackageDescription: 48-Pin Ultra Thin Fine Pitch Quad Flat No-Lead, 7 x 7 x 0.6 mm Body, 0.5 mm Pitch, Exposed Pad; Core: ARM Cortex-M3; Operating Frequency(F) (Processor speed) (MHz): 32; Mounting Technology: Surface Mount; ComponentLink2Description: Mouser; ComponentLink2URL: https://pl.mouser.com/ProductDetail/STMicroelectronics/STM32L552RCT6?qs=sGAEpiMZZMto2ohCYbAIUUJm%252BzcpS0IxFbqkp9%2F0sPoEpVjys%2Fepxg%3D%3D
Y1 = XTAL 32.768KHz: XTAL 32.768KHz crystal; value: 8MHz; Published: 8-Jun-2000; LatestRevisionDate: 17-Jul-2002; LatestRevisionNote: Re-released for DXP Platform.; Publisher: Altium Limited; ComponentLink1Description: Datasheet; ComponentLink1URL: https://datasheet.lcsc.com/szlcsc/1901081604_Seiko-Epson-Q13FC1350000400_C32346.pdf
Y2 = XTAL 8MHz: TXC Corp 7A08000001; Published: 8-Jun-2000; LatestRevisionDate: 17-Jul-2002; LatestRevisionNote: Re-released for DXP Platform.; Publisher: Altium Limited; ComponentLink1Description: Datasheet; ComponentLink1URL: http://www.txccorp.com/download/products/quartz_crystals/2015TXC_7A_28.pdf; value: 8MHz; ComponentLink2Description: JLC; ComponentLink2URL: https://jlcpcb.com/parts/componentSearch?secondSortUuid=09f7e4779fd84e989f34c78148375bf2&name=SMD%20Crystal%20Resonators&firstSortUuid=6771ff6d5925444e85b2121d008b3ccd
P23 P24 = Plug: LatestRevisionDate: 17-Jul-2002; LatestRevisionNote: Re-released for DXP Platform.; Publisher: Altium Limited
S1 = switch: Published: 24-Mar-1999; LatestRevisionDate: 17-Jul-2002; LatestRevisionNote: Re-released for DXP Platform.; PackageReference: SPST-2; Publisher: Altium Limited; PackageDescription: Switch; 2 Leads

## Sheet wifi.SchDoc
size A4
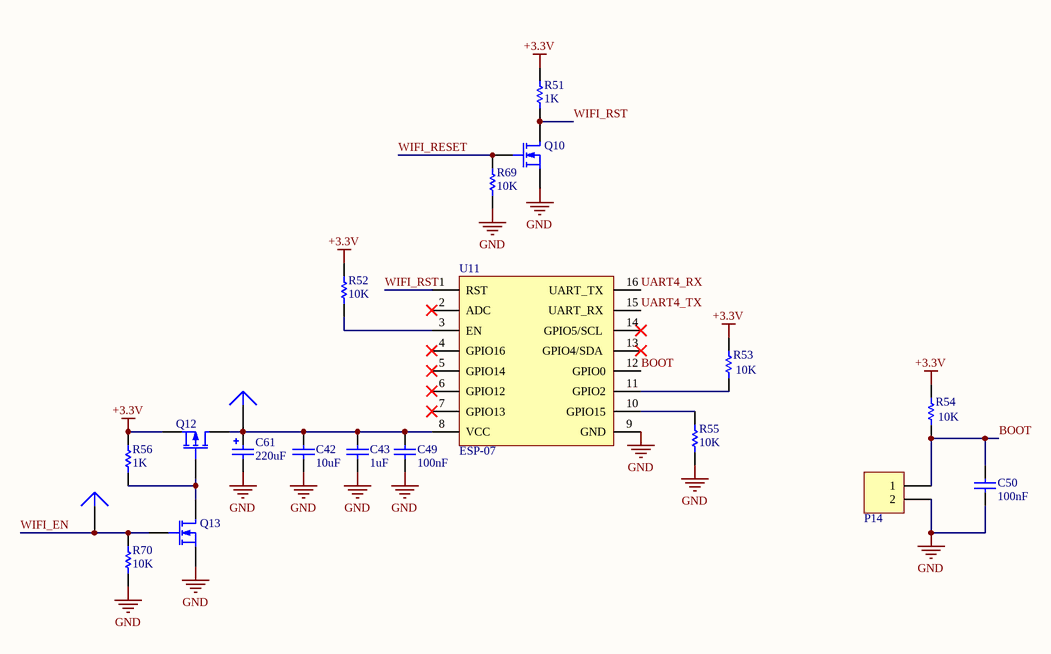
[diagram p4: wifi.SchDoc]

### Parts
C42  value 10uF  [C0402]  (hidden comment: Cap 10uF)
C43  value 1uF  [C0402]  (hidden comment: Cap 1uF)
C49  value 100nF  [C0402]  (hidden comment: Cap 100nF)
C50  value 100nF  [C0402]  (hidden comment: Cap 100nF)
C61  value 220uF  [CAP-D]  (hidden comment: Tantalum 220uF)
P14  Header 2  [HDR1X2]  (value not drawn)
P25  Plug  [pin smd]  (value not drawn)  (no BOM)
P29  Plug  [pin smd]  (value not drawn)  (no BOM)
Q10  AO3400A  [SOT23]  (value not drawn)
Q12  AO3401A  [SOT23]  (value not drawn)
Q13  AO3400A  [SOT23]  (value not drawn)
R51  value 1K  [R0402]  (hidden comment: Res_1K)
R52  value 10K  [R0402]  (hidden comment: Res_10K)
R53  value 10K  [R0402]  (hidden comment: Res_10K)
R54  value 10K  [R0402]  (hidden comment: Res_10K)
R55  value 10K  [R0402]  (hidden comment: Res_10K)
R56  value 1K  [R0402]  (hidden comment: Res_1K)
R69  value 10K  [R0402]  (hidden comment: Res_10K)
R70  value 10K  [R0402]  (hidden comment: Res_10K)
U11  ESP-07  [ESP-07]

### Nets
+3.3V: Q12.2(S) R51.2 R52.2 R53.2 R54.2 R56.2
GND: C42.1 C43.1 C49.1 C50.1 C61.1 P14.2 Q10.2(S) Q13.2(S) R55.1 R69.1 R70.1 U11.9(GND)
BOOT: C50.2 P14.1 R54.1 U11.12(GPIO0)
UART4_RX: U11.16(UART_TX)
UART4_TX: U11.15(UART_RX)
WIFI_EN: P29.1 Q13.1(G) R70.2
WIFI_RESET: Q10.1(G) R69.2
WIFI_RST: Q10.3(D) R51.1 U11.1(RST)
NetC42_2: C42.2 C43.2 C49.2 C61.2 P25.1 Q12.3(D) U11.8(VCC)
NetQ12_1: Q12.1(G) Q13.3(D) R56.1
NetR52_1: R52.1 U11.3(EN)
NetR53_1: R53.1 U11.11(GPIO2)
NetR55_2: R55.2 U11.10(GPIO15)

Not connected (* = marked no-connect by the designer): U11 2(ADC)* 4(GPIO16)* 5(GPIO14)* 6(GPIO12)* 7(GPIO13)* 13(GPIO4/SDA)* 14(GPIO5/SCL)*

### Library data of the parts
C42 = Cap 10uF: Capacitor
C43 = Cap 1uF: Capacitor
C49 C50 = Cap 100nF: Capacitor
C61 = Tantalum 220uF: Polarized Tantalum Capacitor
P14 = Header 2: Header, 2-Pin; LatestRevisionDate: 17-Jul-2002; LatestRevisionNote: Re-released for DXP Platform.; Publisher: Altium Limited
Q10 Q13 = MOSFET-N: N-MOSFET AO3400A; Published: 8-Jun-2000; LatestRevisionDate: 17-Jul-2002; LatestRevisionNote: Re-released for DXP Platform.; PackageVersion: 1995/1996; PackageReference: E3; Publisher: Altium Limited; PackageDescription: TO, Flat Index; 3 In-Line, Axial Leads; Body Dia. 4.6mm; Lead Dia. 0.5 mm (max); ComponentLink1Description: datasheet; ComponentLink1URL: https://datasheet.lcsc.com/szlcsc/1908271131_Youtai-Semiconductor-Co-Ltd-AO3400A_C347475.pdf
Q12 = MOSFET-P: P-Channel MOSFET AO3401A; Published: 8-Jun-2000; LatestRevisionDate: 17-Jul-2002; LatestRevisionNote: Re-released for DXP Platform.; PackageVersion: 1995/1996; PackageReference: E3; Publisher: Altium Limited; PackageDescription: TO, Flat Index; 3 In-Line, Axial Leads; Body Dia. 4.6mm; Lead Dia. 0.5 mm (max); ComponentLink1Description: datasheet; ComponentLink1URL: https://datasheet.lcsc.com/szlcsc/Alpha-Omega-Semicon-AOS-AO3401A_C15127.pdf
R51 R56 = Res_1K: Resistor
R52-R55 R69 R70 = Res_10K: Resistor
U11 = ESP-07: AiThinker ESP-07; ComponentLink1Description: datasheet; ComponentLink1URL: http://wiki.ai-thinker.com/_media/esp8266/esp8266_series_modules_user_manual_v1.1.pdf
P25 P29 = Plug: LatestRevisionDate: 17-Jul-2002; LatestRevisionNote: Re-released for DXP Platform.; Publisher: Altium Limited

## Nets that join several sheets
+3.3V: GSM (6 pins), power (9 pins), sensors (18 pins), mcu (26 pins), wifi (6 pins)
GND: GSM (27 pins), power (55 pins), sensors (22 pins), mcu (38 pins), wifi (12 pins)
1-wire: sensors (R11.2 U10.4), mcu (U6.39)
BAT_IRQ: power (R6.1 U5.4), mcu (U6.61)
BMP_EN: sensors (P26.1 Q5.1 R66.2), mcu (U6.40)
GPS_TX: GSM (U2.37), mcu (U6.25)
GSM_CTS: GSM (U2.10), mcu (U6.14)
GSM_EN: GSM (Q14.1 R58.2), mcu (U6.11)
GSM_LP: GSM (R23.1 R30.2 U2.9), mcu (U6.57)
GSM_RESET: GSM (Q3.1), mcu (U6.54)
GSM_RTS: GSM (U2.11), mcu (U6.15)
GSM_RX: GSM (U2.31), mcu (U6.16)
GSM_TX: GSM (U2.30), mcu (U6.17)
I2C1_SCL: power (P13.1 R50.1 U5.8), sensors (U7.6 U8.4 U9.8), mcu (U6.58)
I2C1_SDA: power (P12.1 R49.1 U5.7), sensors (U7.1 U8.3 U9.7), mcu (U6.59)
QSPI_CLK: sensors (U1.6), mcu (U6.29)
QSPI_CS: sensors (R10.1 U1.1), mcu (U6.20)
QSPI_IO0: sensors (U1.5), mcu (U6.27)
QSPI_IO1: sensors (U1.2), mcu (U6.26)
QSPI_IO2: sensors (U1.3), mcu (U6.23)
QSPI_IO3: sensors (U1.7), mcu (U6.22)
SHT20_EN: sensors (P28.1 Q9.1 R68.2), mcu (U6.28)
STM_CD: GSM (C48.2 R35.2), mcu (U6.21)
STM_GSM13: GSM (U2.38), mcu (U6.2)
UART4_RX: mcu (U6.52), wifi (U11.16)
UART4_TX: mcu (U6.51), wifi (U11.15)
VCNL4040_EN: sensors (P27.1 Q7.1 R67.2), mcu (U6.33)
VCNL4040_IRQ: sensors (U9.6), mcu (U6.38)
WIFI_EN: mcu (U6.62), wifi (P29.1 Q13.1 R70.2)
WIFI_RESET: mcu (U6.53), wifi (Q10.1 R69.2)